# EAGLE design NSL_RFIDdle (EAGLE 5.10)
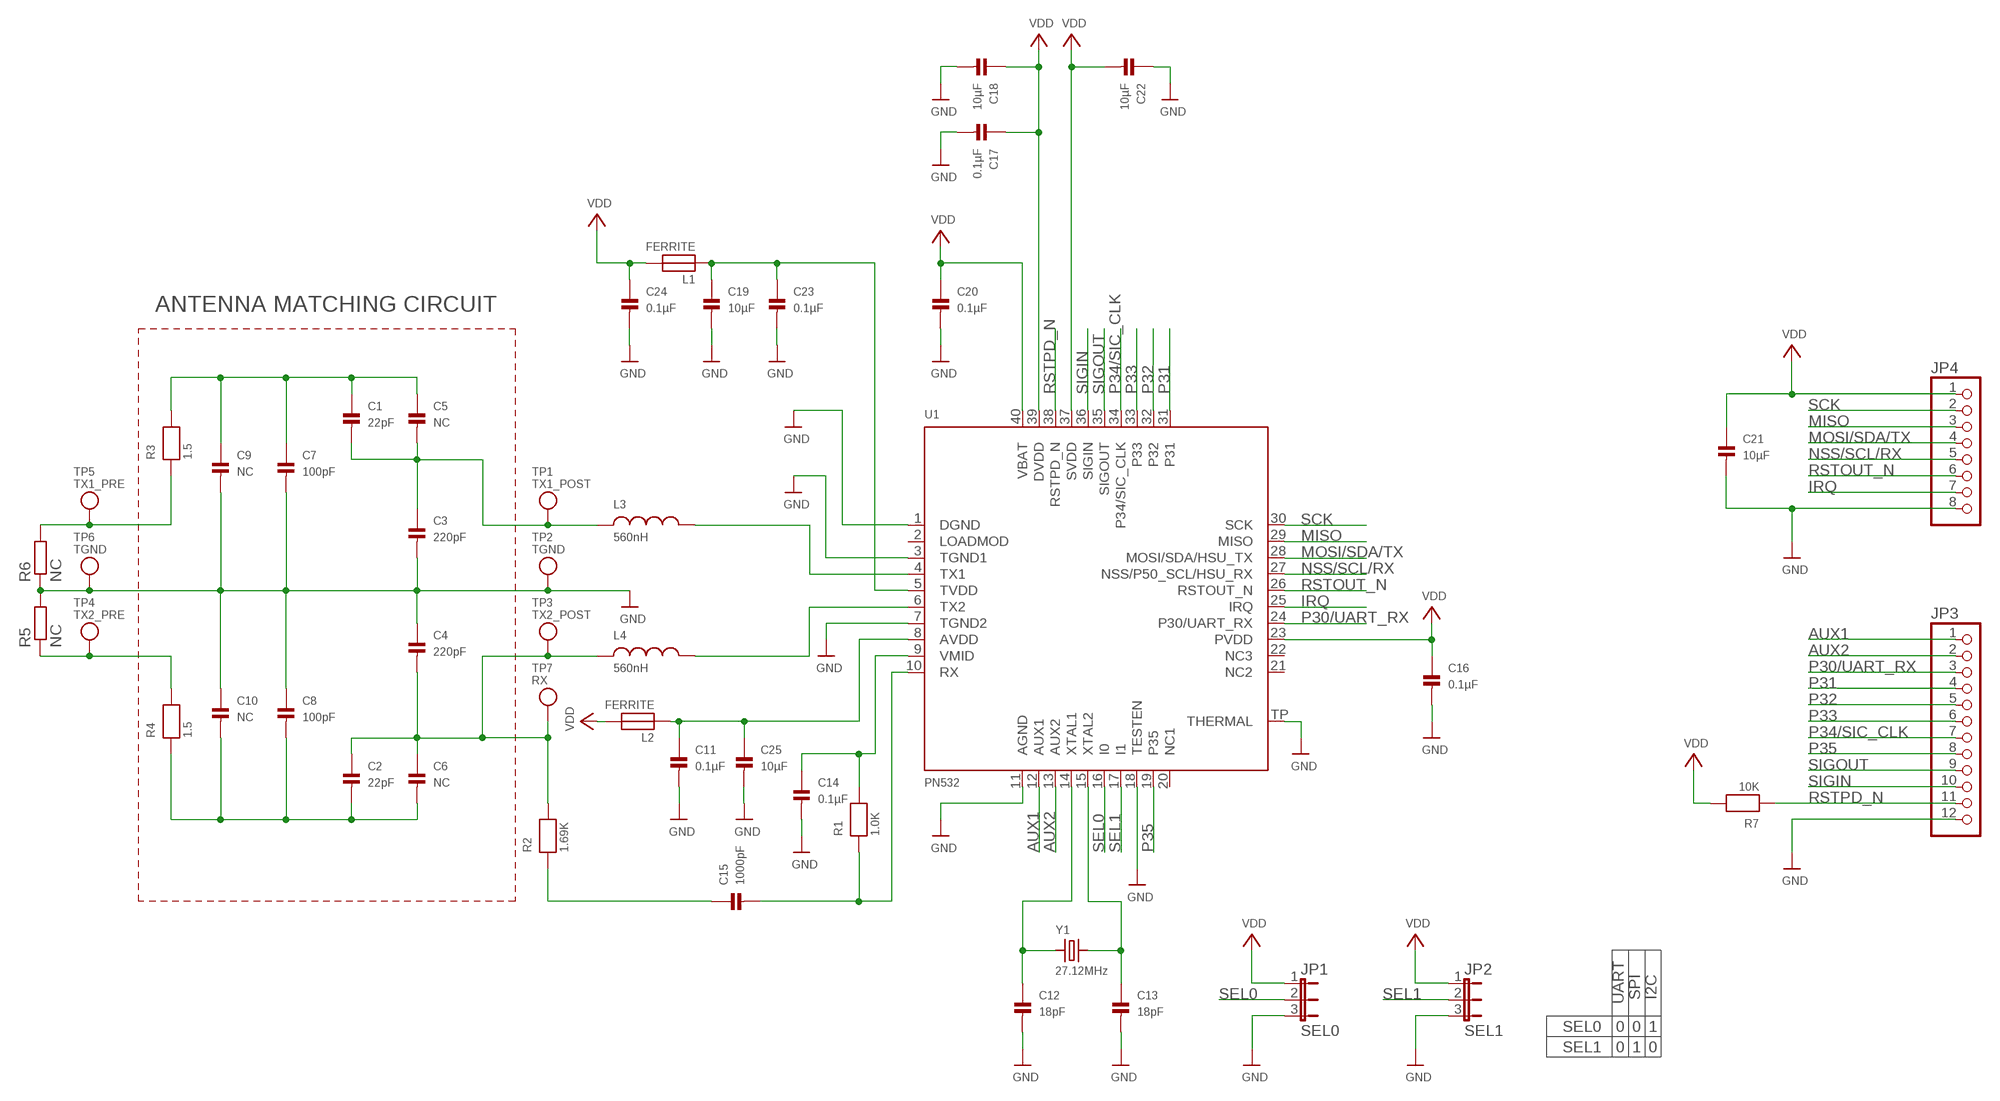
[diagram p0: schematic, sheet 1]

## Parts
C1  22pF  CAP_CERAMIC0603  [0603]
C2  22pF  CAP_CERAMIC0603  [0603]
C3  220pF  CAP_CERAMIC0603  [0603]
C4  220pF  CAP_CERAMIC0603  [0603]
C5  NC  CAP_CERAMIC0603  [0603]
C6  NC  CAP_CERAMIC0603  [0603]
C7  100pF  CAP_CERAMIC0603  [0603]
C8  100pF  CAP_CERAMIC0603  [0603]
C9  NC  CAP_CERAMIC0603  [0603]
C10  NC  CAP_CERAMIC0603  [0603]
C11  0.1µF  CAP_CERAMIC0603  [0603]
C12  18pF  CAP_CERAMIC0603  [0603]
C13  18pF  CAP_CERAMIC0603  [0603]
C14  0.1µF  CAP_CERAMIC0603  [0603]
C15  1000pF  CAP_CERAMIC0805  [0805]
C16  0.1µF  CAP_CERAMIC0603  [0603]
C17  0.1µF  CAP_CERAMIC0603  [0603]
C18  10µF  CAP_CERAMIC0805  [0805]
C19  10µF  CAP_CERAMIC0805  [0805]
C20  0.1µF  CAP_CERAMIC0603  [0603]
C21  10µF  CAP_CERAMIC0805  [0805]
C22  10µF  CAP_CERAMIC0805  [0805]
C23  0.1µF  CAP_CERAMIC0603  [0603]
C24  0.1µF  CAP_CERAMIC0603  [0603]
C25  10µF  CAP_CERAMIC0805  [0805]
JP1  SEL0  JUMPER3  [JUMPER3]
JP2  SEL1  JUMPER3  [JUMPER3]
JP3  HEADER-1X12  [1X12_ROUND]
JP4  HEADER-1X8ROUND  [1X08_ROUND]
L1  FERRITE  [0603]
L2  FERRITE  [0603]
L3  560nH  INDUCTOR0805  [0805]
L4  560nH  INDUCTOR0805  [0805]
R1  1.0K  RESISTOR0603  [0603]
R2  1.69K  RESISTOR0603  [0603]
R3  1.5  RESISTOR0603  [0603]
R4  1.5  RESISTOR0603  [0603]
R5  NC  R-EU_R0201  [R0201]
R6  NC  R-EU_R0201  [R0201]
R7  10K  RESISTOR0603  [0603]
TP1  TX1_POST  TESTPOINTPAD  [TESTPOINT_PAD_2MM]
TP2  TGND  TESTPOINTPAD  [TESTPOINT_PAD_2MM]
TP3  TX2_POST  TESTPOINTPAD  [TESTPOINT_PAD_2MM]
TP4  TX2_PRE  TESTPOINTPAD  [TESTPOINT_PAD_2MM]
TP5  TX1_PRE  TESTPOINTPAD  [TESTPOINT_PAD_2MM]
TP6  TGND  TESTPOINTPAD  [TESTPOINT_PAD_2MM]
TP7  RX  TESTPOINTPAD  [TESTPOINT_PAD_2MM]
U1  PN532  [HVQFN40-6X6]
Y1  27.12MHz  CRYSTALTHIN  [CRYSTAL_3.2X2.5]

## Nets
AUX1: JP3.1 U1.12(AUX1)
AUX2: JP3.2 U1.13(AUX2)
GND: C3.2 C4.1 C7.2 C8.1 C9.2 C10.1 C11.2 C12.2 C13.2 C14.2 C16.2 C17.2 C18.2 C19.2 C20.2 C21.2 C22.1 C23.2 C24.2 C25.2 JP1.3 JP2.3 JP3.12 JP4.8 R5.2 R6.1 TP2.P$1 TP6.P$1 U1.1(DGND) U1.3(TGND1) U1.7(TGND2) U1.11(AGND) U1.18(TESTEN) U1.TP(THERMAL)
IRQ: JP4.7 U1.25(IRQ)
MISO: JP4.3 U1.29(MISO)
MOSI/SDA/TX: JP4.4 U1.28(MOSI/SDA/HSU_TX)
N$1: L3.2 U1.4(TX1)
N$2: L4.2 U1.6(TX2)
N$3: C1.2 C3.1 C5.2 L3.1 TP1.P$1
N$4: R3.1 R6.2 TP5.P$1
N$5: R4.2 R5.1 TP4.P$1
N$7: C12.1 U1.14(XTAL1) Y1.1
N$8: C13.1 U1.15(XTAL2) Y1.2
N$9: C15.1 R2.1
N$10: C14.1 R1.2 U1.9(VMID)
N$11: C15.2 R1.1 U1.10(RX)
N$12: C2.1 C4.2 C6.1 L4.1 R2.2 TP3.P$1 TP7.P$1
N$13: C11.1 C25.1 L2.1 U1.8(AVDD)
N$14: C19.1 C23.1 L1.1 U1.5(TVDD)
NSS/SCL/RX: JP4.5 U1.27(NSS/P50_SCL/HSU_RX)
P30/UART_RX: JP3.3 U1.24(P30/UART_RX)
P31: JP3.4 U1.31
P32: JP3.5 U1.32
P33: JP3.6 U1.33
P34/SIC_CLK: JP3.7 U1.34(P34/SIC_CLK)
P35: JP3.8 U1.19(P35)
RSTOUT_N: JP4.6 U1.26(RSTOUT_N)
RSTPD_N: JP3.11 R7.1 U1.38(RSTPD_N)
SCK: JP4.2 U1.30(SCK)
SEL0: JP1.2 U1.16(I0)
SEL1: JP2.2 U1.17(I1)
SIGIN: JP3.10 U1.36(SIGIN)
SIGOUT: JP3.9 U1.35(SIGOUT)
TX1_ANTENNA: C1.1 C5.1 C7.1 C9.1 R3.2
TX2_ANTENNA: C2.2 C6.2 C8.2 C10.2 R4.1
VDD: C16.1 C17.1 C18.1 C20.1 C21.1 C22.2 C24.1 JP1.1 JP2.1 JP4.1 L1.2 L2.2 R7.2 U1.23(PVDD) U1.37(SVDD) U1.39(DVDD) U1.40(VBAT)
Unconnected: U1.2(LOADMOD) U1.20(NC1) U1.21(NC2) U1.22(NC3)

## Notes on the sheet
- ANTENNA MATCHING CIRCUIT
- UART | SPI | I2C
- SEL0 | 0 | 0 | 1
- SEL1 | 0 | 1 | 0

## Library data of the parts
C1-C25 = microbuilder:CAP_CERAMIC: Ceramic Capacitors 0402 - 0402 Surface Mount Capacitors 16pF 50V 5% [Digikey: 445-4899-2-ND] 18pF 50V 5% [Digikey: 490-1281-2-ND] 22pF 50V 5% [Digikey: 490-1283-2-ND] 68pF 50V 5% [Digikey: 490-1289-2-ND] 0.1uF 10V 10% [Digikey: 490-1318-2-ND] 0603 - 0603 Surface Mount Capacitors 16 pF 50V 5% [Digikey: 445-5051-2-ND] 22 pF 50V [Digikey: PCC220ACVTR-ND] 33 pF 50V 5% [Digikey: 490-1415-1-ND] 56pF 50V 5% [Digikey: 490-1421-1-ND] 220pF 50V 5% [Digikey: 445-1285-1-ND] 680 pF 50V 2200 pF 50V 5% C0G [Digikey: 445-1297-1-ND] 5600 pF 100V 5% X7R [Digikey: 478-3711-1-ND] 0.1 µF 25V 10% [Digikey: PCC2277TR-ND] 0.22 µF 16V 10% X7R [Digikey: 445-1318-1-ND] 1.0 µF 25V 10% [Digikey: 445-5146-2-ND] 0603 - RF Specific 3pF 250V +/-0.1pF RF [Digikey: 712-1347-1-ND] 18 pF 250V 5% [Digikey: 478-3505-1-ND or 712-1322-1-ND] 56 pF 250V 5% C0G RF [Digikey: 490-4867-1-ND] 68 pF 250V RF [Digikey: 490-4868-1-ND] 0805 - 0805 Surface Mount Capacitors 220 pF 250V 2% RF Ceramic Capacitor [Digikey: 712-1398-1-ND] 1000 pF 50V 2% NP0 Ceramic Capacitor [Digikey: 478-3760-1-ND] 0.1 µF 25V 10% Ceramic Capacitor [Digikey: PCC1828TR-ND] 1.0 µF 16V 10% Ceramic Capacitor[Digikey: 490-1691-2-ND] 10.0 µF 10V 10% Ceramic Capacitor[Digikey: 709-1228-1-ND] 47 uF 6.3V 20% Ceramic Capacitor [Digikey: 399-5506-1-ND] 1206 - 1206 Surface Mount Capacitors 47uF 10V 20% Ceramic Capacitor [Digikey: 399-5508-1-ND]
JP1 JP2 = microbuilder:JUMPER3: JUMPER - 3 Pins
JP3 = microbuilder:HEADER-1X12
JP4 = microbuilder:HEADER-1X8: PIN HEADER
L1 L2 = microbuilder:FERRITE: Ferrite Bead 0603 MMZ1608B121C - 120 Ohm, 600mA Ferrite Chip - Digikey: 445-2164-1-ND BK1608HW121-T - 120 Ohm, 600mA Ferrite Chip - Digikey: 587-1876-2-ND
L3 L4 = microbuilder:INDUCTOR: Inductors 0603: 10nH Ceramic Inductor - microwire antenna/RF (Digikey: 712-1434-2-ND) 0805: 560nH Ceramic Inductor - RF (Digikey: 553-1047-1-ND) 1007 (2518 Metric) SMT: 10µH 10% 250mOhm 820mA 1007 Inductor (Digikey: 587-2189-1-ND) 22µH 10% 500mOhm 580mA 1007 Inductor (Digikey: 587-2190-1-ND) 47µH 10% 950mOhm 420mA 1007 Inductor (Digikey: 587-2191-1-ND) 47µH 5% 100mOhm 1A 1008 Inductor (Digikey: 732-1816-1-ND)
R1-R4 R7 = microbuilder:RESISTOR: Resistors 0402 - 0402 Surface Mount Package 22 Ohm 1% 1/16W [Digikey: 311-22.0LRTR-ND] 10.0K 1% 1/16W [Digikey: 311-10.0KLRTR-ND] 10.0K 5% 1/16W [Digikey: RMCF0402JT10K0TR-ND] 12.1K 1% 1/16W [Digikey: 311-22.0LRTR-ND] 0603 - 0603 Surface Mount Package 0 Ohm 1/10 Watt 1% Resistor 15 Ohm 1/10 Watt 1% Resistor 33 Ohm 1/10 Watt 1% Resistor 49.9 Ohm 1/10 Watt 1% Resistor 100 Ohm 1/10 Watt 1% Resistor 150 Ohm 1/10 Watt 1% Resistor 240 Ohm 1/10 Watt 1% Resistor 390 Ohm 1/10 Watt 1% Resistor 560 Ohm 1/10 Watt 1% Resistor 750 Ohm 1/10 Watt 1% Resistor 1.0K Ohm 1/10 Watt 1% Resistor 1.5K Ohm 1/10 Watt 1% Resistor 2.0K Ohm 1/10 Watt 1% Resistor 4.7K Ohm 1/10 Watt 1% Resistor 10.0K Ohm 1/10 Watt 1% Resistor 20.0K Ohm 1/10 Watt 1% Resistor 33.0K Ohm 1/10 Watt 1% Resistor 100.0K Ohm 1/10 Watt 1% Resistor 0805 - 0805 Surface Mount Package 0 Ohm 1/8 Watt 1% Resistor 33 Ohm 1/8 Watt 1% Resistor 100 Ohm 1/8 Watt 1% Resistor 150 Ohm 1/8 Watt 1% Resistor 200 Ohm 1/8 Watt 1% Resistor 240 Ohm 1/8 Watt 1% Resistor 330 Ohm 1/8 Watt 1% Resistor 390 Ohm 1/8 Watt 1% Resistor 470 Ohm 1/8 Watt 1% Resistor 1.0K Ohm 1/8 Watt 1% Resistor 1.5K Ohm 1/8 Watt 1% Resistor 2.0K Ohm 1/8 Watt 1% Resistor 4.7K Ohm 1/8 Watt 1% Resistor 5.1K Ohm 1/8 Watt 1% Resistor 5.6K Ohm 1/8 Watt 1% Resistor 10.0K Ohm 1/8 Watt 1% Resistor 22.0K Ohm 1/8 Watt 1% Resistor 33.0K Ohm 1/8 Watt 1% Resistor 100K Ohm 1/8 Watt 1% Resistor 1206 - 1206 Surface Mount Package
R5 R6 = rcl:R-EU_: RESISTOR, European symbol
TP1-TP7 = microbuilder:TESTPOINT: Test Point TESTPOINT_SMT - Compact Surface Mount Test Point [Digikey: 5016KTR-ND] TESTPOINT_PAD - Square Pad (2mm) TESTPOINT_SMT - Round Pad (2mm) TESTPOINT_0.1" - 0.1" Header
U1 = microbuilder:PN532: PN532 - Near Field Communication (NFC) controller Highly integrated transceiver module for contactless communication at 13.56 MHz (14443A/MIFARE, FeliCa, I4443B)
Y1 = microbuilder:CRYSTAL: Crystals HC49UP - Surface Mount Crystal 4.0MHz 18pF +/-30ppm Surface Mount Crystal [Digikey: 535-9857-1-ND] 12.0 MHz Surface Mount Crystal [Digikey: 535-9869-6-ND] 25.0 MHz Surface Mount Crystal [Digikey: 535-9078-1-ND] 3.2 x 2.5mm - MEMs SMT Crystal 12.0 MHz 8pF 15ppm 3.2 x 2.5mm Crystal [Digikey: 644-1047-1-ND] 16.0 MHz 8pF 15ppm 3.2 x 2.5mm Crystal [Digikey: 644-1049-1-ND] 16.0 MHz 10pF 10ppm 3.2 x 2.5mm Crystal [Digikey: 644-1100-1-ND] 27.12 MHz 18pF 30ppm 3.2 x 2.5mm Crystal [Digikey: 887-1424-1-ND] 4.9 x 1.8mm - MEMs SMT Crystal 32.768 KHz 12.5pF 20ppm 4.9 x 1.8mm Crystal [Digikey: SE2415CT-ND] Cylinder 32.768KHz Cylinder Crystal

## Board
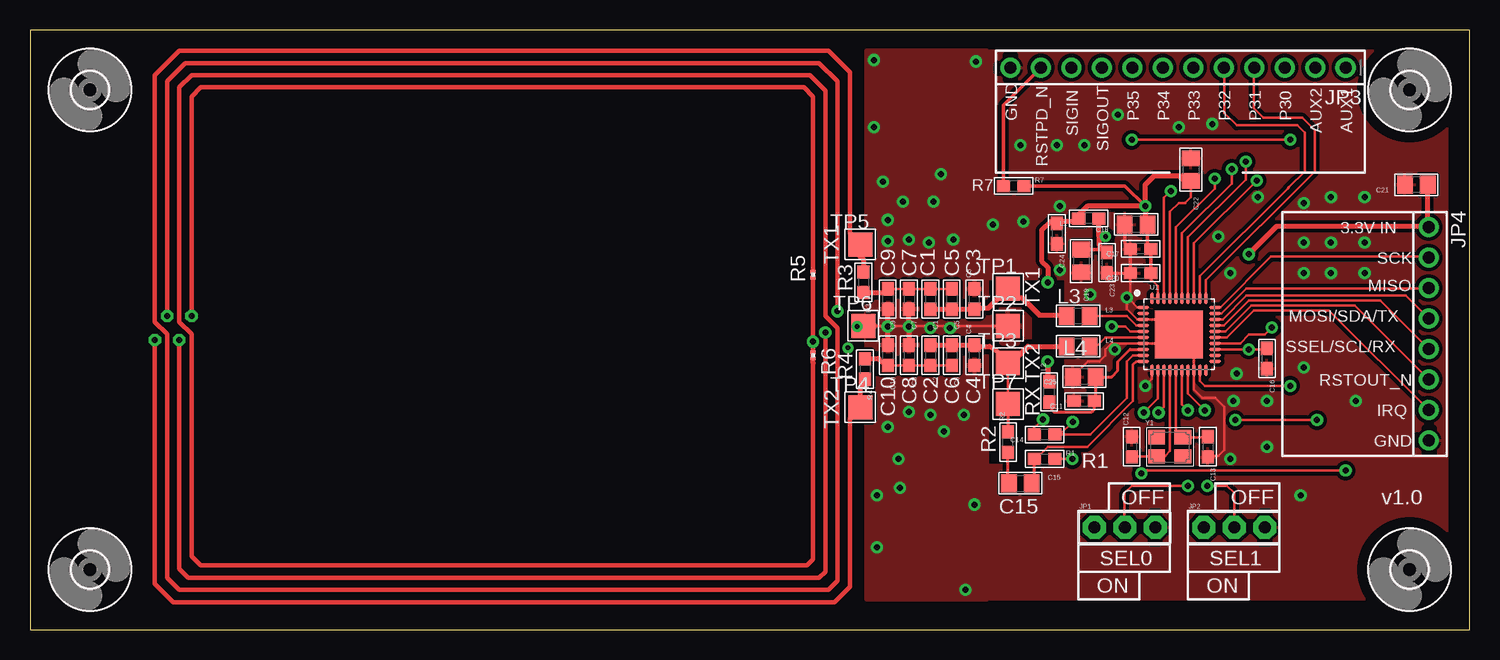
[diagram p1: board, top side]
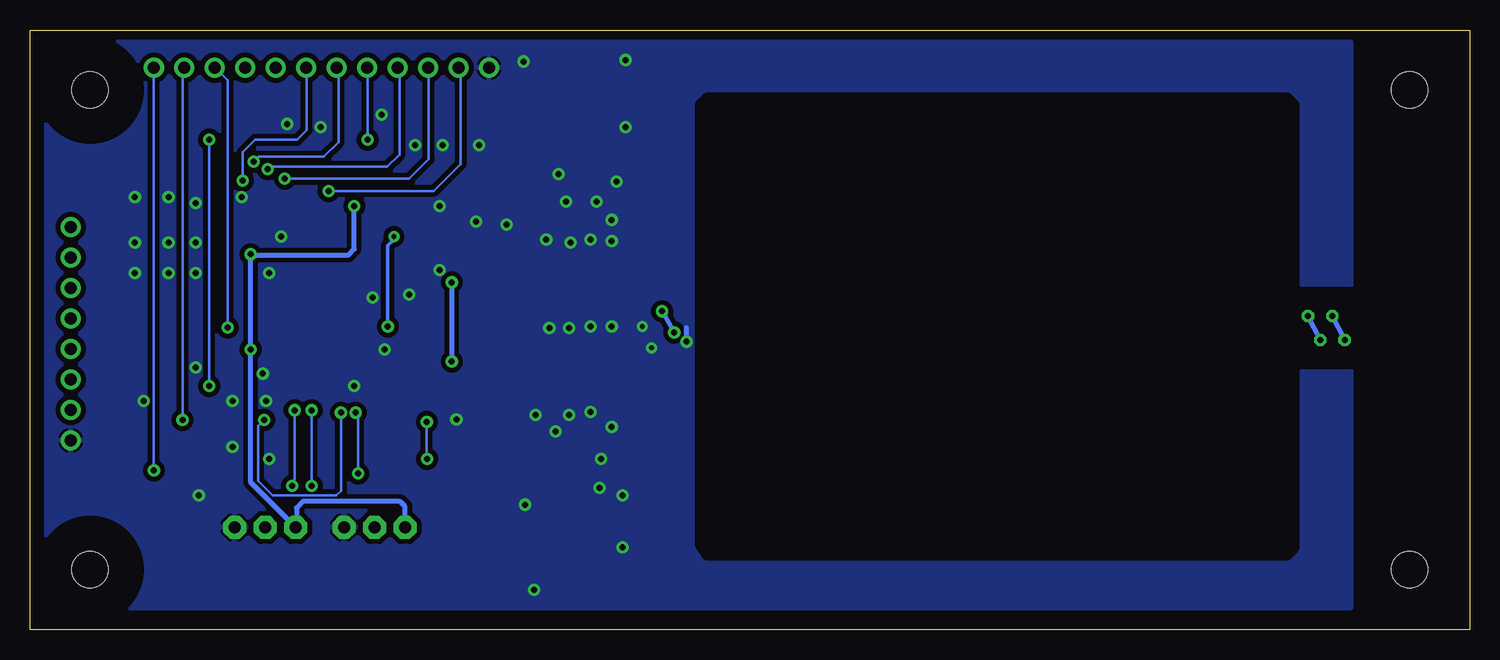
[diagram p2: board, bottom side, seen from below]

Size 120 x 50 mm. Coordinates in mm from the lower left corner, seen from the top.
Outline: 0,0 120,0 120,50 0,50 0,0
Copper layers (1*16): Top 0.035mm / dielectric 1.5mm / Bottom 0.035mm
Design rules "PCBCart-Standard": minimum track width 8mil, minimum drill 0.4mm, track to track 8mil, track to pad 8mil, pad to pad 8mil, via to via 8mil, smd to smd 8mil, copper to edge 20mil, drill to drill 8mil, minimum pad ring 8mil, minimum via ring 10mil, stop-mask expansion 3mil, vias tented up to drill 0mil, thermal gap 8mil
tRestrict: area 81.4,47.8 to 82,47.9; area 81.4,45.8 to 82,46; area 80.6,46.5 to 80.8,47.1; area 116.3,16.6 to 117,16.8; area 116.3,14.7 to 117,14.9; area 115.6,15.5 to 115.7,16.1; area 102.6,7.2 to 103.3,7.4; area 102.6,9.7 to 103.3,9.8; area 101.6,8.3 to 101.7,8.9; area 92.6,8.3 to 92.7,8.9; area 93.5,9.7 to 94.1,9.8; area 93.5,7.2 to 94.1,7.4; 5 more areas
bRestrict: area 14.7,6.3 to 64,44.2; area 9.1,26.9 to 14.2,28.2; area 9.1,22.1 to 14.2,23.4

### Footprints (pad centres in the part's own frame; a part is rotated, then mirrored left to right if it is on the bottom)
0603 = smd 1.1 x 1: 1 -0.85,0; 2 0.85,0
0805 = smd 1.3 x 1.5: 1 -0.95,0; 2 0.95,0
JUMPER3 = drill 1 pad 1.93 octagon: 1 -2.54,0; 2 0,0; 3 2.54,0
1X12_ROUND = drill 1 pad 1.676 round: 1 -13.97,0; 2 -11.43,0; 3 -8.89,0; 4 -6.35,0; 5 -3.81,0; 6 -1.27,0; 7 1.27,0; 8 3.81,0; 9 6.35,0; 10 8.89,0; 11 11.43,0; 12 13.97,0
1X08_ROUND = drill 1 pad 1.676 round: 1 -8.89,0; 2 -6.35,0; 3 -3.81,0; 4 -1.27,0; 5 1.27,0; 6 3.81,0; 7 6.35,0; 8 8.89,0
R0201 = smd 0.28 x 0.43: 1 -0.255,0; 2 0.255,0
TESTPOINT_PAD_2MM = smd 2 x 2: P$1 0,0
HVQFN40-6X6 = smd 1 x 0.25: 1 -2.99,2.25; 2 -2.99,1.75; 3 -2.99,1.25; 4 -2.99,0.75; 5 -2.99,0.25; 6 -2.99,-0.25; 7 -2.99,-0.75; 8 -2.99,-1.25; 9 -2.99,-1.75; 10 -2.99,-2.25; 21 2.99,-2.25; 22 2.99,-1.75; 23 2.99,-1.25; 24 2.99,-0.75; 25 2.99,-0.25; 26 2.99,0.25; 27 2.99,0.75; 28 2.99,1.25; 29 2.99,1.75; 30 2.99,2.25 | smd 0.25 x 1: 11 -2.25,-2.99; 12 -1.75,-2.99; 13 -1.25,-2.99; 14 -0.75,-2.99; 15 -0.25,-2.99; 16 0.25,-2.99; 17 0.75,-2.99; 18 1.25,-2.99; 19 1.75,-2.99; 20 2.25,-2.99; 31 2.25,2.99; 32 1.75,2.99; 33 1.25,2.99; 34 0.75,2.99; 35 0.25,2.99; 36 -0.25,2.99; 37 -0.75,2.99; 38 -1.25,2.99; 39 -1.75,2.99; 40 -2.25,2.99 | smd 4 x 4: TP 0,0
MOUNTINGHOLE_3.0 = hole 3: 0,0
CRYSTAL_3.2X2.5 = smd 1.4 x 1.2: 1 -1.1,-0.8; 2 1.1,0.8; GND1 -1.1,0.8; GND2 1.1,-0.8

### Placement (x,y rotation side)
C1  75.06,27.56 270 top
C2  75.06,22.86 270 top
C3  78.74,27.56 90 top
C4  78.74,22.86 90 top
C5  76.84,27.56 270 top
C6  76.84,22.86 270 top
C7  73.28,27.56 270 top
C8  73.28,22.86 270 top
C9  71.5,27.56 270 top
C10  71.5,22.86 270 top
C11  87.88,19.05 180 top
C12  91.84,15.24 90 top
C13  98.19,15.24 270 top
C14  84.58,16.26 180 top
C15  82.55,12.19 0 top
C16  103.12,22.61 270 top
C17  92.58,31.75 180 top
C18  92.2,33.78 180 top
C19  87.63,30.73 270 top
C20  92.58,29.72 180 top
C21  115.57,37.08 180 top
C22  96.77,38.35 270 top
C23  89.79,30.61 270 top
C24  85.6,33.02 270 top
C25  87.88,21.08 180 top
JP1  91.28,8.51 0 top
JP2  100.39,8.51 0 top
JP3  95.7,46.87 180 top
JP4  116.59,24.67 270 top
L1  88.27,34.29 180 top
L2  84.96,19.81 90 top
L3  87.38,26.16 0 top
L4  87.38,23.62 0 top
R1  84.58,14.22 0 top
R2  81.53,15.62 90 top
R3  69.47,28.96 270 top
R4  69.6,21.72 270 top
R5  65.28,29.59 90 top
R6  65.28,22.86 270 top
R7  82,37 0 top
TP1  81.53,28.43 0 top
TP2  81.53,25.33 0 top
TP3  81.53,22.22 0 top
TP4  69.22,18.54 0 top
TP5  69.22,32.11 0 top
TP6  69.48,25.33 0 top
TP7  81.53,18.8 0 top
U1  95.79,24.62 0 top
U$6  [MOUNTINGHOLE_3.0]  5,45 0 top
U$36  [MOUNTINGHOLE_3.0]  5,5 0 top
U$37  [MOUNTINGHOLE_3.0]  115,5 0 top
U$38  [MOUNTINGHOLE_3.0]  115,45 0 top
Y1  95.01,15.24 0 top

### Tracks (layer width: path | path; a pad name or v marks a point on that pad's centre or on a via)
AUX1  (via drill 0.5)
  Top 0.203: v109.67,13.27 92.92,13.27 v92.66,13.01 | 93.07,18.29 v92.86,18.09 94.04,19.26 U1.12
  Bottom 0.203: JP3.1 v109.67,13.27 109.73,13.21 | v92.66,13.01 92.66,17.88 v92.86,18.09
AUX2  (via drill 0.5)
  Top 0.203: U1.13 94.54,18.54 v94.08,18.09 | v100.48,17.48 v107.29,17.48
  Bottom 0.203: v94.08,18.09 94.08,11.58 94.49,11.18 99.77,11.18 100.99,12.39 100.99,16.97 v100.48,17.48 | v107.29,17.48 107.29,46.71 JP3.2
GND  (via drill 0.4, 0.5)
  Top 0.203: U1.1 92.33,26.87 91.73,27.47 C20.2 | C13.2 98.53,14.48 99.06,14.48 99.57,14.99 99.57,18.54 98.81,19.3 97.74,19.3 97.04,20 U1.18 97.04,23.37 U1.TP | TP6.P$1 73.28,25.33 TP2.P$1 | U1.11 93.54,20.9 v92.96,20.32 | 94.74,23.88 94.74,23.87 U1.7 90.18,23.87 90.17,23.88 89.66,23.37 89.66,22.86 89.15,22.35 88.2,22.35 C25.2 | 93.98,26.42 94.23,26.42 94.23,25.91 arc-90 94.2,25.87 U1.3 92.32,25.87 91.44,26.75 v91.44,27.69 | v84.45,17.53 83.44,16.55 C14.2
  Top 0.254: C17.2 91.25,32.23 | C23.2 89.83,29.72 C20.2
  Top 0.305: C20.2 C17.2 | 91.25,32.23 C18.2
  Top 0.356: R5.2 v65.28,24 R6.1
  Top 0.406: C8.1 73.28,25.33 C7.2 | C10.1 C9.2 | 65.28,22.23 R6.1
  Bottom 0.406: v65.28,24 65.28,25.15
  other vias: 71.12,37.34 72.52,11.81 76.2,16.51 73.28,32.51 74.93,32.26 71.5,32.38 72.39,14.22 71.5,16.89 77.85,17.91 75.06,17.91 68.96,25.27 71.5,25.27 73.28,25.27 75.06,25.15 76.71,25.15 68.2,23.5 76.96,32.51 71.5,34.16 72.77,35.69 75.95,37.97 75.31,35.69 73.28,18.16 103.12,19.05 100.58,21.34 106.17,21.84 100.08,14.22 90.42,23.37 88.39,27.94 80.26,33.78 82.55,40.39 85.6,40.39 87.88,40.39 90.68,42.93 95.76,41.91 98.55,42.16 102.36,36.07 99.06,32.77 110.51,19.05 111.25,29.72 108.46,29.72 106.17,29.72 106.17,32.26 108.46,32.26 111.25,32.26 111.25,36.07 108.46,36.07 106.17,35.56 103.12,15.24 105.92,11.18 85.85,29.97 85.85,35.31 82.8,34.04 70.36,41.91 70.36,47.5 70.61,11.18 70.61,6.86 77.98,3.3 78.74,10.41 78.87,47.37 100.08,29.72 100.33,19.05
  pour Top (isolate 0.305): 80.01,48.26 118.11,48.26 118.11,2.54 80.01,2.54 80.01,13.72 86.36,13.72 86.36,29.21 80.01,29.21
  pour Top (isolate 0.406): 69.72,48.26 79.76,48.26 79.76,2.54 69.72,2.54
  pour Top (isolate 0.406): 80.01,26.67 83.31,26.67 83.31,23.62 80.01,23.62
  pour Bottom (isolate 0.406): 9.91,1.78 118.62,1.78 118.62,49.02 9.91,49.02
IRQ
  Top 0.203: U1.25 99.76,24.37 102.01,26.62 108.29,26.62 JP4.7
MISO
  Top 0.203: U1.29 99.32,26.37 101.4,28.45 116.56,28.45 JP4.3
MOSI/SDA/TX
  Top 0.203: U1.28 99.43,25.87 101.4,27.84 114.69,27.84 JP4.4
N$1
  Top 0.203: U1.4 92.23,25.37 91.44,26.16 L3.2
N$2
  Top 0.203: U1.6 89.65,24.37 88.9,23.62 L4.2
N$3
  Top 0.203: C1.2 C5.2 | 86.36,26.23 L3.1 | 80.98,27.9 81.53,27.9 81.53,27.81
  Top 0.406: TP1.P$1 80.98,28.39 80.98,27.9 79.88,26.8 78.83,26.8 C3.1 C1.2 | 86.36,26.23 84.14,26.23 82.68,27.69 81.66,27.69 81.53,27.81
N$4
  Top 0.356: TP5.P$1 68.33,33 68.33,46.47 66.55,48.26 12.45,48.26 10.41,46.23 10.41,25.65 11.43,24.64 11.43,4.32 12.45,3.3 66.55,3.3 67.31,4.06 67.31,25.15 66.29,26.16 66.29,44.96 65.02,46.23 13.46,46.23 12.45,45.21 12.45,25.65 13.46,24.64 13.46,6.1 14.22,5.33 64.77,5.33 65.28,5.84 R6.2
  Top 0.406: R3.1 69.47,30.86 68.96,31.37 68.96,32.1 TP5.P$1
N$5  (via drill 0.5)
  Top 0.356: v10.41,24.13 10.41,3.81 11.94,2.29 67.06,2.29 68.33,3.56 68.33,17.65 TP4.P$1 | v11.43,26.16 11.43,45.72 12.95,47.24 65.79,47.24 67.31,45.72 v67.31,26.54 | v66.29,24.77 66.29,4.83 65.79,4.32 13.21,4.32 12.45,5.08 v12.45,24.13 | v13.46,26.16 13.46,44.45 14.22,45.21 64.52,45.21 65.28,44.45 R5.1 65.28,29.21
  Top 0.406: R4.2 69.6,20.57 69.22,20.19 TP4.P$1
  Bottom 0.406: v11.43,26.16 v10.41,24.13 | v67.31,26.54 v66.29,24.77 | v12.45,24.13 v13.46,26.16
N$7
  Top 0.203: C12.1 91.63,14.44 Y1.1 93.95,14.48 94.63,14.48 95.04,14.89 U1.14
N$8
  Top 0.203: C13.1 98.39,16.04 Y1.2 95.54,16.61 U1.15
N$9
  Top 0.254: R2.1 81.53,12.26 C15.1
N$10  (via drill 0.5)
  Top 0.203: U1.9 91.96,22.87 91.44,22.35 91.44,19.3 88.39,16.26 C14.1 85.85,16.26 v86.92,17.32 | R1.2 v86.89,14.22
  Bottom 0.203: v86.92,17.32 86.92,14.25 v86.89,14.22
N$11
  Top 0.203: U1.10 92.22,22.37 91.95,22.1 91.95,19.05 88.14,15.24 84.84,15.24 83.82,14.22 R1.1
  Top 0.254: C15.2 83.73,12.42 R1.1
N$12
  Top 0.203: L4.1 86.36,23.56 | TP3.P$1 TP7.P$1
  Top 0.254: TP7.P$1 R2.2
  Top 0.406: C2.1 C6.1 C4.2 78.57,23.62 80.01,23.62 81.53,22.61 TP3.P$1 82.04,22.73 82.3,22.73 83.19,23.62 L4.1
N$13
  Top 0.203: L2.1 84.96,18.54
  Top 0.254: U1.8 91.7,23.37 90.68,22.35 90.68,21.59 90.17,21.08 C25.1 88.83,19.4 C11.1 88.73,18.38 88.52,18.16 85.34,18.16 84.96,18.54
N$14  (via drill 0.41, 0.5)
  Top 0.203: U1.5 91.72,24.87 91.31,25.27 v90.17,25.27
  Top 0.305: C23.1 89.51,31.68 C19.1 | v89.66,32.77 89.11,32.77
  Top 0.406: 89.51,31.68 89.11,32.08 89.11,32.77 L1.1
  Bottom 0.305: v90.17,25.27 90.17,32 89.66,32.51 v89.66,32.77
NSS/SCL/RX
  Top 0.203: U1.27 99.54,25.37 101.6,27.43 112.56,27.43 JP4.5
P30/UART_RX  (via drill 0.5)
  Top 0.203: U1.24 100.88,23.87 101.6,24.59 102.92,24.59 v103.53,25.2
  Bottom 0.203: v103.53,25.2 103.53,45.81 JP3.3
P31
  Top 0.203: U1.31 98.04,29.16 107.09,38.2 107.09,41.66 106.07,42.67 102.82,42.67 102.01,43.48 102.01,46.82 JP3.4
P32
  Top 0.203: JP3.5 99.57,46.81 99.57,43.08 100.58,42.06 105.66,42.06 106.27,41.45 106.27,38.2 104.95,36.88 104.85,36.78 97.54,29.47 U1.32
P33  (via drill 0.5)
  Top 0.203: U1.33 97.04,32.22 v102.26,37.44
  Bottom 0.203: v102.26,37.44 102.26,39.83 101.24,40.84 97.74,40.84 96.93,41.66 96.93,46.82 JP3.6
P34/SIC_CLK  (via drill 0.5)
  Top 0.203: U1.34 96.54,32.73 101.35,37.54 v101.35,39.01
  Bottom 0.203: JP3.7 94.28,46.72 94.28,40.64 95.5,39.42 100.94,39.42 v101.35,39.01
P35  (via drill 0.5)
  Top 0.203: U1.19 97.54,20.72 97.94,20.32 v105.05,20.32 | v105.05,40.84 v91.85,40.84
  Bottom 0.203: v105.05,20.32 v105.05,40.84 | v91.85,40.84 91.85,46.82 JP3.8
RSTOUT_N
  Top 0.203: U1.26 99.65,24.87 101.8,27.03 110.42,27.03 JP4.6
RSTPD_N  (via drill 0.5)
  Top 0.203: U1.38 94.54,36.02 v95.1,36.58
  Top 0.305: R7.1 81.15,43.75 JP3.11
  Bottom 0.203: v95.1,36.58 86.36,36.58 84.12,38.81 84.12,46.72 JP3.11
SCK
  Top 0.203: U1.30 99.21,26.87 103.43,31.09 116.52,31.09 JP4.2
SEL0  (via drill 0.5)
  Top 0.203: U1.16 96.04,18.77 v96.52,18.29 | v96.52,11.99 91.85,11.99 91.24,11.38 91.24,8.55 JP1.2
  Bottom 0.203: v96.52,11.99 v96.52,18.29
SEL1  (via drill 0.5)
  Top 0.203: U1.17 96.54,19.69 v97.94,18.29 | v98.15,11.99 99.77,11.99 100.38,11.38 JP2.2
  Bottom 0.203: v97.94,18.29 97.94,12.19 v98.15,11.99
SIGIN  (via drill 0.5)
  Top 0.203: U1.36 95.54,33.56 98.75,36.78 v98.75,37.59
  Bottom 0.203: v98.75,37.59 88.39,37.59 86.77,39.22 86.77,46.82 JP3.10
SIGOUT  (via drill 0.5)
  Top 0.203: U1.35 96.04,33.05 100.18,37.19 v100.18,38.41
  Bottom 0.203: v100.18,38.41 99.97,38.61 90.22,38.61 89.2,39.62 89.2,46.72 JP3.9
TX1_ANTENNA
  Top 0.203: C9.1 C7.1 C1.1 C5.1
  Top 0.406: R3.2 71.2,28.11 C9.1
TX2_ANTENNA
  Top 0.203: C10.2 C8.2 C2.2 C6.2
  Top 0.406: C10.2 71.34,22.01 70.74,22.61 69.89,22.61 R4.1
VDD  (via drill 0.5)
  Top 0.203: U1.37 95.04,34.84 95.76,35.56 96.32,35.56 96.32,35.61 96.77,36.07 C22.2 | C16.1 103.04,23.37 v101.6,23.37 U1.23 | 116.52,33.63 JP4.1 | C22.2 96.1,37.4 | 96.72,37.35 C22.2 | U1.40 U1.39 94.04,28.64 93.43,29.25 | 93.15,32.03 C17.1
  Top 0.254: 96.25,37.35 96.72,37.35
  Top 0.305: C17.1 C20.1 | 93.43,29.69 93.43,29.25 | C18.1 93.15,32.03 | R7.2 91.27,37 v92.96,35.31
  Top 0.406: C21.1 116.52,33.63 103.94,33.63 v101.6,31.29 | v92.96,35.31 92.96,33.78 C18.1 | v92.96,35.31 88.14,35.31 87.41,34.58 L1.2 87.41,34.04 85.6,34.04 | L2.2 84.84,21.3 v84.84,22.35 | 85.6,34.04 85.09,34.04 84.33,33.27 84.33,30.73 84.84,30.23 v84.84,28.96 | 85.6,34.04 C24.1 | 96.25,37.35 95.76,37.85 93.73,37.85 92.96,37.08 v92.96,35.31 | C20.1 93.43,29.69
  Bottom 0.203: 97.79,8.57 JP2.1
  Bottom 0.406: JP1.1 88.74,10.25 89.15,10.67 97.28,10.67 97.79,10.16 97.79,8.57 | JP2.1 101.6,12.26 v101.6,23.37 v101.6,31.29 101.55,31.24 93.43,31.24 92.96,31.71 v92.96,35.31 | v84.84,28.96 v84.84,22.35

### Text on the board
tPlace: GND | P35 | P34 | P33 | P32 | P31 | P30 | SIGIN | AUX2 | AUX1 | SIGOUT | RSTPD_N | R7 | 3.3V IN | TX1 | SCK | C9 | C7 | C1 | C5 | C3 | R3 | MISO | TX1 | L3 | MOSI/SDA/TX | L4 | SSEL/SCL/RX | R4 | TX2 | RSTOUT_N | C8 | C2 | C6 | C4 | C10 | RX | IRQ | TX2 | R2 | GND | R1 | C15 | OFF | OFF | v1.0 | SEL0 | SEL1 | ON | ON